# Altium schematic sheet moreConnectors.SchDoc
size A; SheetNumber: 5; SheetTotal: 5
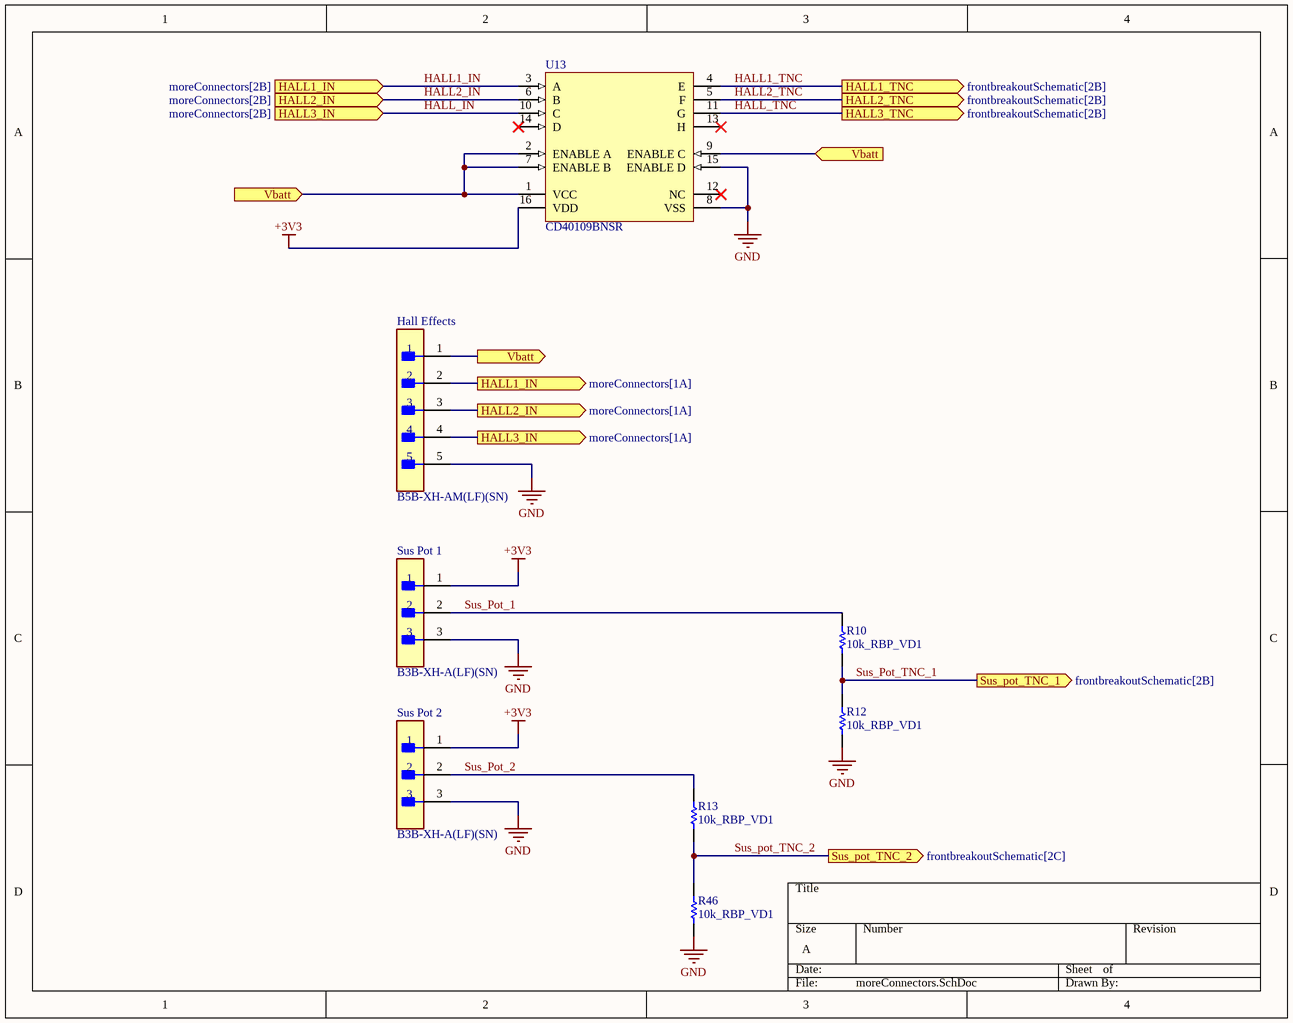
[diagram p0: moreConnectors.SchDoc]

## Parts
Hall_Effects  B5B-XH-AM(LF)(SN)  [FP-B5B-XH-AM_LF_SN-MFG]
R10  10k_RBP_VD1  [RESC2013X60X40LL20T25]
R12  10k_RBP_VD1  [RESC2013X60X40LL20T25]
R13  10k_RBP_VD1  [RESC2013X60X40LL20T25]
R46  10k_RBP_VD1  [RESC2013X60X40LL20T25]
Sus_Pot_1  B3B-XH-A(LF)(SN)  [FP-B3B-XH-A_LF_SN-MFG]
Sus_Pot_2  B3B-XH-A(LF)(SN)  [FP-B3B-XH-A_LF_SN-MFG]
U13  CD40109BNSR  [NS0016A_N]

## Ports
HALL1_IN (in, see moreConnectors[2B]), HALL1_IN (out, see moreConnectors[1A]), HALL1_TNC (out, see frontbreakoutSchematic[2B]), HALL2_IN (in, see moreConnectors[2B]), HALL2_IN (out, see moreConnectors[1A]), HALL2_TNC (out, see frontbreakoutSchematic[2B]), HALL3_IN (in, see moreConnectors[2B]), HALL3_IN (out, see moreConnectors[1A]), HALL3_TNC (out, see frontbreakoutSchematic[2B]), Sus_pot_TNC_1 (out, see frontbreakoutSchematic[2B]), Sus_pot_TNC_2 (out, see frontbreakoutSchematic[2C]), Vbatt (in, see frontbreakoutSchematic[1B], frontbreakoutSchematic[4B], moreConnectors[1A], moreConnectors[2B]), Vbatt (in, see frontbreakoutSchematic[1B], frontbreakoutSchematic[4B], moreConnectors[2B], moreConnectors[3A]), Vbatt (out, see frontbreakoutSchematic[1B], frontbreakoutSchematic[4B], moreConnectors[1A], moreConnectors[3A])

## Nets
+3V3: Sus_Pot_1.1 Sus_Pot_2.1 U13.16(VDD)
GND: Hall_Effects.5 R12.1 R46.1 Sus_Pot_1.3 Sus_Pot_2.3 U13.8(VSS) U13.15(ENABLE_D)
HALL1_IN: Hall_Effects.2 U13.3(A) ; port HALL1_IN
HALL1_TNC: U13.4(E) ; port HALL1_TNC
HALL2_IN: Hall_Effects.3 U13.6(B) ; port HALL2_IN
HALL2_TNC: U13.5(F) ; port HALL2_TNC
HALL_IN: Hall_Effects.4 U13.10(C) ; port HALL3_IN
HALL_TNC: U13.11(G) ; port HALL3_TNC
Sus_Pot_1: R10.2 Sus_Pot_1.2
Sus_Pot_2: R13.2 Sus_Pot_2.2
Sus_Pot_TNC_1: R10.1 R12.2 ; port Sus_pot_TNC_1
Sus_pot_TNC_2: R13.1 R46.2 ; port Sus_pot_TNC_2
Vbatt: Hall_Effects.1 U13.1(VCC) U13.2(ENABLE_A) U13.7(ENABLE_B) U13.9(ENABLE_C) ; port Vbatt

Not connected (* = marked no-connect by the designer): U13 12(NC)* 13(H)* 14(D)*

## Library data of the parts
Hall_Effects = CMP-17439-000304-1: CONN HEADER VERT 5POS 2.5MM; Mated Stacking Heights: 9.8mm; Voltage Rating: 250V; Max Current Rating: 3A; Number of Positions: 5; Contact Resistance: 20mR; Depth: 5.75mm; Connector Type: Header; Color: Green; Insulation Material: Nylon; Contact Plating: Copper; Length: 14.9mm; Fastening Type: Detent; Contact Material: Brass; Number of Rows: 1; Contact Type: Male Pin; Housing Material: Polyamide; Housing Color: White; Lead Free: Lead Free; Max Voltage Rating (AC): 250V; Mount: Through Hole; Contact Shape: Square; Min Operating Temperature: -25°C; Packaging: Bulk; Orientation: Straight; Insulation Color: Natural; Series: XH; Flammability Rating: UL94 V-0; Contact Finish - Mating: TIN; Max Operating Temperature: 85°C; Termination: Solder; Pitch: 2.5mm
R10 R12 R13 R46 = CMP-2001-00877-1: Manufacturer: Panasonic; Part Number: ERA6AEB7870V
Sus_Pot_1 Sus_Pot_2 = CMP-17439-000014-3: CONN HEADER VERT 3POS 2.5MM; Max Voltage Rating (DC): 250V; Number of Positions: 3; Current Rating: 3A; Gender: Male; Wire/Cable Gauge: 22AWG; Contact Resistance: 20mR; Insulation Resistance: 1GR; Insulation Material: Nylon; Contact Plating: Tin; Depth: 5.75mm; Contact Type: Male Pin; Max Operating Temperature: 85°C; Insulation Color: Natural; Voltage Rating (AC): 250V; Color: Natural; Connector Type: Header; Orientation: Straight; Fastening Type: Detent; Housing Color: White; Min Operating Temperature: -25°C; Termination: Solder; Voltage Rating: 250V; Series: XH; Pitch: 2.5mm; Contact Shape: Square; Number of Rows: 1; Lead Free: Lead Free; Packaging: Bulk; Mount: Through Hole; Flammability Rating: UL94 V-0; Max Voltage Rating (AC): 250V; REACH SVHC: No SVHC; Housing Material: Polyamide; Contact Material: Brass; Lead Pitch: 2.5mm; Contact Finish - Mating: TIN; Length: 9.9mm; Max Current Rating: 3A; Number of Contacts: 3
U13 = CMP-1527-00005-2: CMOS Quad Low-to-High Voltage Level Shifter, 3 to 18 V, -55 to 125 degC, 16-Pin SO (NS16), RoHS, Tape and Reel; Manufacturer: Texas Instruments; Number of Channels: 4; VSS: 3 to 18 V; Propagation Delay: 240 ns Max.; ComponentLink2Description: Datasheet; PackageDescription: 16-Pin Plastic Small Outline Package, Body 10.2 x 5.3 mm, Pitch 1.27 mm; Mounting Technology: Surface Mount; Number of Outputs: 4; ComponentLink3URL: http://www.ti.com/lit/ml/msop002a/msop002a.pdf; Packing: Tape and Reel; RoHS: TRUE; Temperature Range: -55 to 125 degC; PartNumber: CD40109BNSR; PackageVersion: 4040062/C; ComponentLink3Description: Package Specification; DatasheetVersion: SCHS099B; ComponentLink2URL: http://www.ti.com/lit/ds/symlink/cd40109b.pdf; Package Reference: NS0016A; Number of Bits: 4; ComponentLink1Description: Manufacturer URL; ComponentLink1URL: www.ti.com